# Altium schematic sheet nRF7002-DK.SchDoc
size A4; Date: Date; CompanyName: HESSO; Engineer: Name; Address1: Route du Rawyl 47; Address2: 1950 Sion; Address3: Switzerland; DocumentNumber: 3; SheetNumber: 1; SheetTotal: 3; ProjectName: Project Name
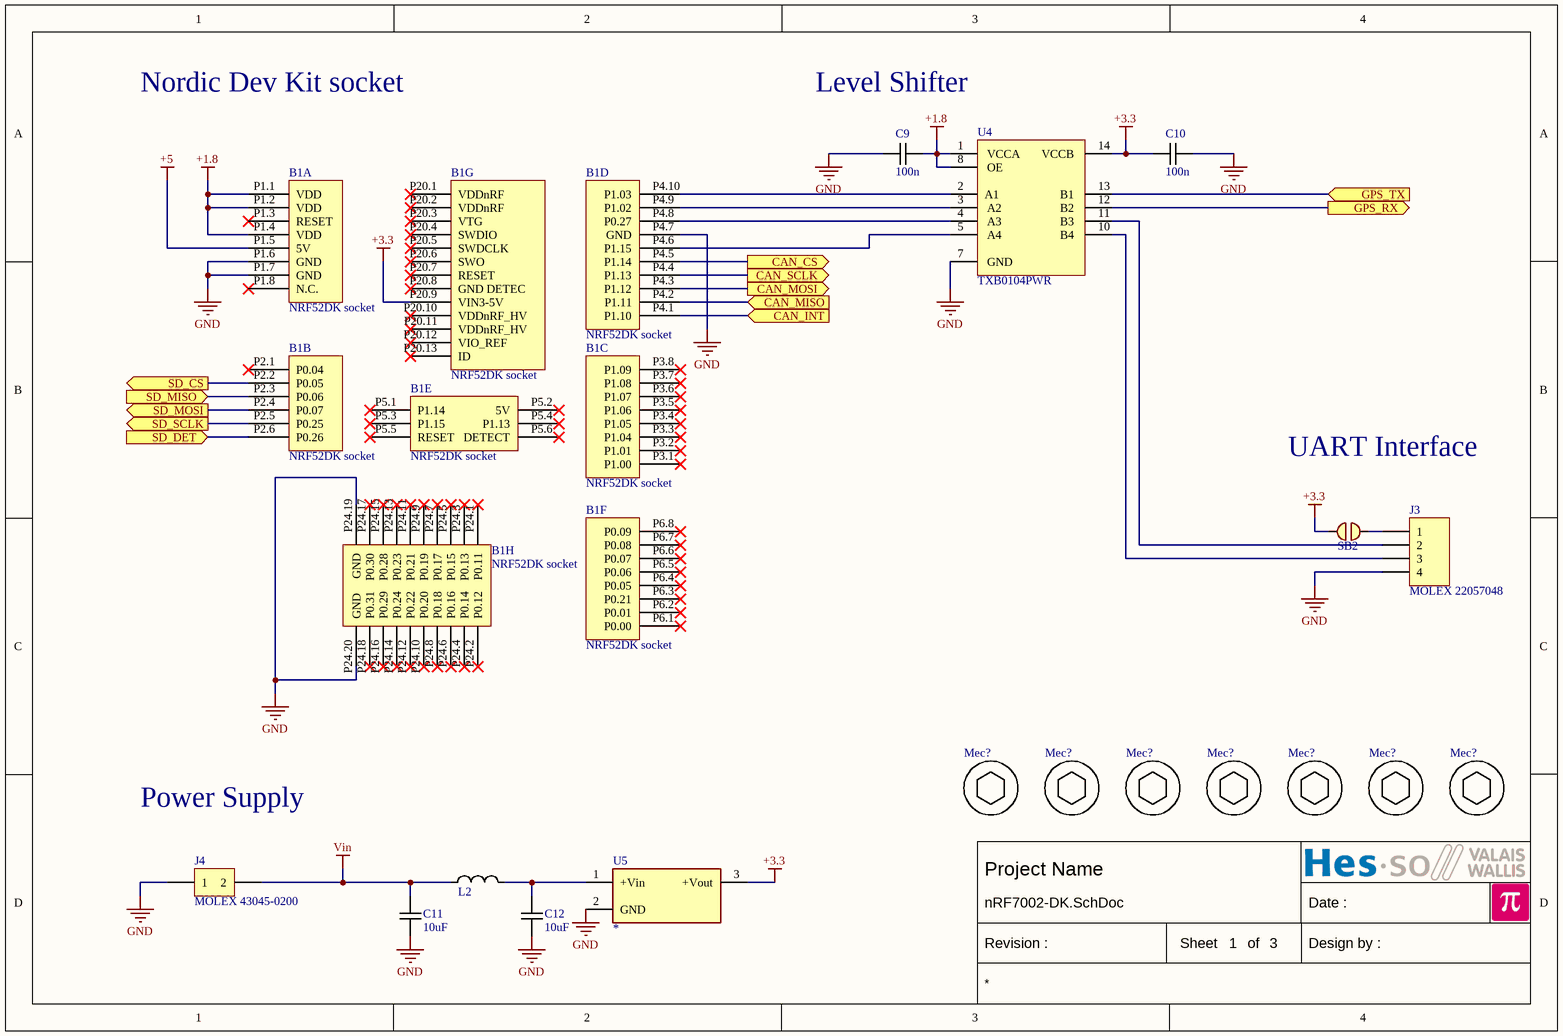
[diagram p0: nRF7002-DK.SchDoc]

## Parts
(Parts that share a designator on the sheet are numbered #1, #2 ... from top to bottom, then left to right.)
B1  NRF52DK socket  [nRF5340DK SOCKET]  (parts A,B,C,D,E,F,G,H of 8)
C9  100n  [CAPACITOR 1608 REFLOW]
C10  100n  [CAPACITOR 1608 REFLOW]
C11  10uF  [CAPACITOR 3216 REFLOW]
C12  10uF  [CAPACITOR 3216 REFLOW]
J3  MOLEX 22057048  [MOLEX 22057048]
J4  MOLEX 43045-0200  [MOLEX 43045-0200]
L2  *  [INDUCTOR 4532 REFLOW]  (value not drawn)
Mec?#1  (no value)  [Screw Hex Socket M3X5 Unconnected]
Mec?#2  (no value)  [Screw Hex Socket M3X5 Unconnected]
Mec?#3  (no value)  [Screw Hex Socket M3X5 Unconnected]
Mec?#4  (no value)  [Screw Hex Socket M3X5 Unconnected]
Mec?#5  (no value)  [Screw Hex Socket M3X5 Unconnected]
Mec?#6  (no value)  [Screw Hex Socket M3X5 Unconnected]
Mec?#7  (no value)  [Screw Hex Socket M3X5 Unconnected]
SB2  *  [Solder Bridge 1mm Unconnected]  (value not drawn)  (net tie, no BOM)
U4  TXB0104PWR  [TSSOP14 P0.65 C4.4x5.0 H1.1]
U5  *  [TRACO TSR 1]

## Ports
CAN_CS (out), CAN_INT (in), CAN_MISO (in), CAN_MOSI (out), CAN_SCLK (out), GPS_RX (out), GPS_TX (in), SD_CS (out), SD_DET (in), SD_MISO (in), SD_MOSI (out), SD_SCLK (out)

## Nets
+1.8: B1.P1.1(VDD) B1.P1.2(VDD) B1.P1.4(VDD) C9.1 U4.1(VCCA) U4.8(OE)
+3.3: B1.P20.9(VIN3-5V) C10.2 SB2.2 U4.14(VCCB) U5.3(+Vout)
+5: B1.P1.5(5V)
GND: B1.P1.6(GND) B1.P1.7(GND) B1.P4.7(GND) B1.P24.19(GND) B1.P24.20(GND) C9.2 C10.1 C11.2 C12.2 J3.4 J4.1 U4.7(GND) U5.2(GND)
Vin: C11.1 J4.2 L2.1
CAN_CS: B1.P4.5(P1.14) ; port CAN_CS
CAN_INT: B1.P4.1(P1.10) ; port CAN_INT
CAN_MISO: B1.P4.2(P1.11) ; port CAN_MISO
CAN_MOSI: B1.P4.3(P1.12) ; port CAN_MOSI
CAN_SCLK: B1.P4.4(P1.13) ; port CAN_SCLK
GPS_RX: U4.12(B2) ; port GPS_RX
GPS_TX: U4.13(B1) ; port GPS_TX
SD_CS: B1.P2.2(P0.05) ; port SD_CS
SD_DET: B1.P2.6(P0.26) ; port SD_DET
SD_MISO: B1.P2.3(P0.06) ; port SD_MISO
SD_MOSI: B1.P2.4(P0.07) ; port SD_MOSI
SD_SCLK: B1.P2.5(P0.25) ; port SD_SCLK
NetB1_P4.6: B1.P4.6(P1.15) U4.5(A4)
NetB1_P4.8: B1.P4.8(P0.27) U4.4(A3)
NetB1_P4.9: B1.P4.9(P1.02) U4.3(A2)
NetB1_P4.10: B1.P4.10(P1.03) U4.2(A1)
NetC12_1: C12.1 L2.2 U5.1(+Vin)
NetJ3_1: J3.1 SB2.1
NetJ3_2: J3.2 U4.11(B3)
NetJ3_3: J3.3 U4.10(B4)

Not connected (* = marked no-connect by the designer): B1 P1.3(RESET)* P1.8(N.C.)* P2.1(P0.04)* P3.1(P1.00)* P3.2(P1.01)* P3.3(P1.04)* P3.4(P1.05)* P3.5(P1.06)* P3.6(P1.07)* P3.7(P1.08)* P3.8(P1.09)* P5.1(P1.14)* P5.2(5V)* P5.3(P1.15)* P5.4(P1.13)* P5.5(RESET)* P5.6(DETECT)* P6.1(P0.00)* P6.2(P0.01)* P6.3(P0.21)* P6.4(P0.05)* P6.5(P0.06)* P6.6(P0.07)* P6.7(P0.08)* P6.8(P0.09)* P20.1(VDDnRF)* P20.2(VDDnRF)* P20.3(VTG)* P20.4(SWDIO)* P20.5(SWDCLK)* P20.6(SWO)* P20.7(RESET)* P20.8(GND_DETEC)* P20.10(VDDnRF_HV)* P20.11(VDDnRF_HV)* P20.12(VIO_REF)* P20.13(ID)* P24.1(P0.11)* P24.2(P0.12)* P24.3(P0.13)* P24.4(P0.14)* P24.5(P0.15)* P24.6(P0.16)* P24.7(P0.17)* P24.8(P0.18)* P24.9(P0.19)* P24.10(P0.20)* P24.11(P0.21)* P24.12(P0.22)* P24.13(P0.23)* P24.14(P0.24)* P24.15(P0.28)* P24.16(P0.29)* P24.17(P0.30)* P24.18(P0.31)*

## Notes on the sheet
- Nordic Dev Kit socket
- Level Shifter
- UART Interface
- Power Supply
- Date :
- Revision :
- Sheet
- of
- Design by :

## Library data of the parts
B1 = nRF5340DK Socket: nRF53 development kit; Value: NRF52DK socket
C9-C12 = Capacitor: Value: *
J3 = MOLEX 22057048: KK 254 Wire-to-Board Header, Right-Angle, 4 Circuits
J4 = MOLEX 43045-0200: Micro-Fit 3.0 Right-Angle Header, 3.00mm, Dual Row, 2 Circuits
L2 = Inductor: Value: *
Mec?#1-Mec?#7 = Screw Hex Socket Unconnected: Screw Hex Socket Unconnected BN610
SB2 = Solderbridge Unconnected: Value: *
U4 = TXB0104PWR: 4-Bit Bidirectional Voltage-Level Translator With utomatic Direction Sensing and ±15-kV ESD Protection; Value: TXB0104PWR
U5 = TRACO TSR 1: DC/DC Converter; Value: *